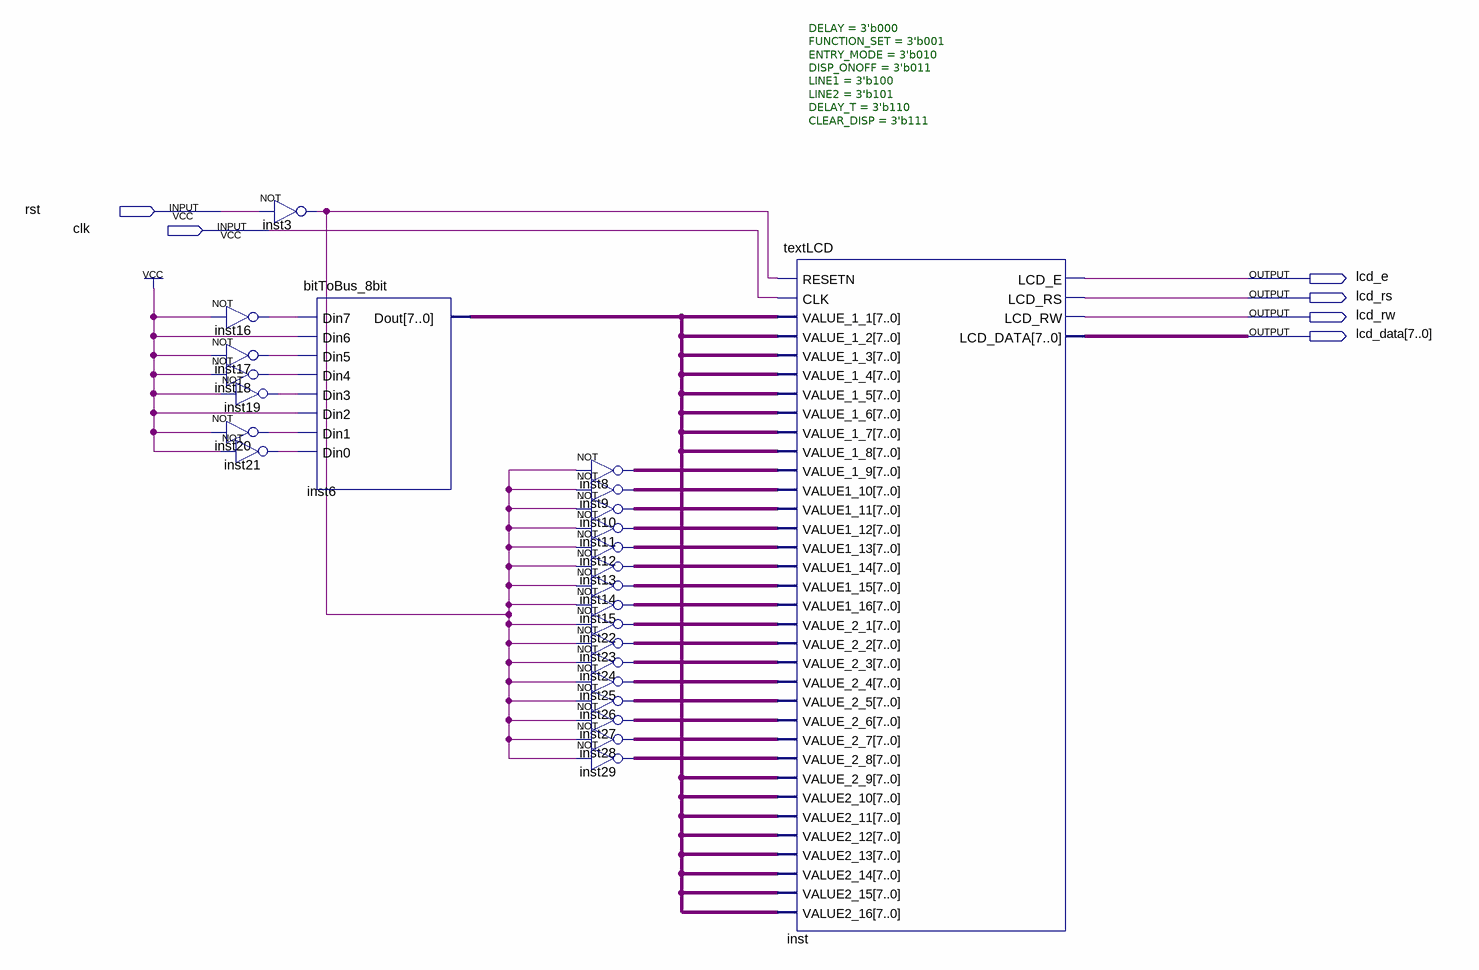
[diagram p0: schematic sheet]
// Quartus schematic lcd_test.bdf as structural Verilog: 25 symbols, 6 pins
module lcd_test (
  input  rst,
  input  clk,
  output lcd_e,
  output lcd_rs,
  output lcd_rw,
  output [7:0] lcd_data
);

  wire inst3_out, inst16_out, inst17_out, inst18_out, inst19_out, inst20_out, inst21_out;
  wire [7:0] inst6_dout, inst8_out, inst9_out, inst10_out, inst11_out, inst12_out, inst13_out, inst14_out,
       inst15_out, inst22_out, inst23_out, inst24_out, inst25_out, inst26_out, inst27_out, inst28_out,
       inst29_out;

  not inst3 (inst3_out, rst);
  not inst16 (inst16_out, 1'b1);
  not inst17 (inst17_out, 1'b1);
  not inst18 (inst18_out, 1'b1);
  not inst19 (inst19_out, 1'b1);
  not inst20 (inst20_out, 1'b1);
  not inst21 (inst21_out, 1'b1);
  bitToBus_8bit inst6 (
    .Din7(inst16_out), .Din6(1'b1), .Din5(inst17_out), .Din4(inst18_out), .Din3(inst19_out), .Din2(1'b1),
    .Din1(inst20_out), .Din0(inst21_out), .Dout(inst6_dout));
  assign inst8_out = ~{8{inst3_out}};  // NOT inst8, 8 bits wide
  assign inst9_out = ~{8{inst3_out}};  // NOT inst9, 8 bits wide
  assign inst10_out = ~{8{inst3_out}};  // NOT inst10, 8 bits wide
  assign inst11_out = ~{8{inst3_out}};  // NOT inst11, 8 bits wide
  assign inst12_out = ~{8{inst3_out}};  // NOT inst12, 8 bits wide
  assign inst13_out = ~{8{inst3_out}};  // NOT inst13, 8 bits wide
  assign inst14_out = ~{8{inst3_out}};  // NOT inst14, 8 bits wide
  assign inst15_out = ~{8{inst3_out}};  // NOT inst15, 8 bits wide
  assign inst22_out = ~{8{inst3_out}};  // NOT inst22, 8 bits wide
  assign inst23_out = ~{8{inst3_out}};  // NOT inst23, 8 bits wide
  assign inst24_out = ~{8{inst3_out}};  // NOT inst24, 8 bits wide
  assign inst25_out = ~{8{inst3_out}};  // NOT inst25, 8 bits wide
  assign inst26_out = ~{8{inst3_out}};  // NOT inst26, 8 bits wide
  assign inst27_out = ~{8{inst3_out}};  // NOT inst27, 8 bits wide
  assign inst28_out = ~{8{inst3_out}};  // NOT inst28, 8 bits wide
  assign inst29_out = ~{8{inst3_out}};  // NOT inst29, 8 bits wide
  textLCD #(.DELAY(3'b000), .FUNCTION_SET(3'b001), .ENTRY_MODE(3'b010), .DISP_ONOFF(3'b011), .LINE1(3'b100), .LINE2(3'b101), .DELAY_T(3'b110), .CLEAR_DISP(3'b111)) inst (
    .RESETN(inst3_out), .CLK(clk), .VALUE_1_1(inst6_dout), .VALUE_1_2(inst6_dout), .VALUE_1_3(inst6_dout),
    .VALUE_1_4(inst6_dout), .VALUE_1_5(inst6_dout), .VALUE_1_6(inst6_dout), .VALUE_1_7(inst6_dout),
    .VALUE_1_8(inst6_dout), .VALUE_1_9(inst8_out), .VALUE1_10(inst9_out), .VALUE1_11(inst10_out),
    .VALUE1_12(inst11_out), .VALUE1_13(inst12_out), .VALUE1_14(inst13_out), .VALUE1_15(inst14_out),
    .VALUE1_16(inst15_out), .VALUE_2_1(inst22_out), .VALUE_2_2(inst23_out), .VALUE_2_3(inst24_out),
    .VALUE_2_4(inst25_out), .VALUE_2_5(inst26_out), .VALUE_2_6(inst27_out), .VALUE_2_7(inst28_out),
    .VALUE_2_8(inst29_out), .VALUE_2_9(inst6_dout), .VALUE2_10(inst6_dout), .VALUE2_11(inst6_dout),
    .VALUE2_12(inst6_dout), .VALUE2_13(inst6_dout), .VALUE2_14(inst6_dout), .VALUE2_15(inst6_dout),
    .VALUE2_16(inst6_dout), .LCD_E(lcd_e), .LCD_RS(lcd_rs), .LCD_RW(lcd_rw), .LCD_DATA(lcd_data));
endmodule
